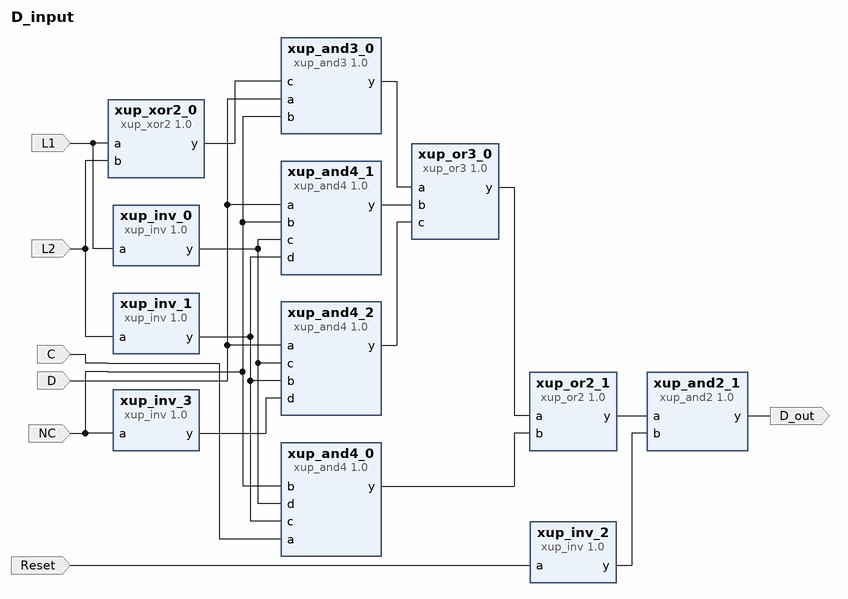
[diagram p0: block diagram of the top level]
# Vivado block design D_input, xc7a35tcpg236-1, Vivado 2017.4
create_bd_design D_input

create_bd_port -dir I L1
create_bd_port -dir I L2
create_bd_port -dir I C
create_bd_port -dir I NC
create_bd_port -dir O D_out
create_bd_port -dir I Reset
create_bd_port -dir I D

create_bd_cell -type ip -vlnv xilinx.com:XUP:xup_and4:1.0 xup_and4_0
create_bd_cell -type ip -vlnv xilinx.com:XUP:xup_xor2:1.0 xup_xor2_0
create_bd_cell -type ip -vlnv xilinx.com:XUP:xup_inv:1.0 xup_inv_0
create_bd_cell -type ip -vlnv xilinx.com:XUP:xup_inv:1.0 xup_inv_1
create_bd_cell -type ip -vlnv xilinx.com:XUP:xup_or2:1.0 xup_or2_1
create_bd_cell -type ip -vlnv xilinx.com:XUP:xup_and2:1.0 xup_and2_1
create_bd_cell -type ip -vlnv xilinx.com:XUP:xup_inv:1.0 xup_inv_2
create_bd_cell -type ip -vlnv xilinx.com:XUP:xup_and4:1.0 xup_and4_1
create_bd_cell -type ip -vlnv xilinx.com:XUP:xup_and3:1.0 xup_and3_0
create_bd_cell -type ip -vlnv xilinx.com:XUP:xup_and4:1.0 xup_and4_2
create_bd_cell -type ip -vlnv xilinx.com:XUP:xup_inv:1.0 xup_inv_3
create_bd_cell -type ip -vlnv xilinx.com:XUP:xup_or3:1.0 xup_or3_0

# ---- connections ----

connect_bd_net -net L1_1 [get_bd_ports L1] [get_bd_pins xup_inv_0/a] [get_bd_pins xup_xor2_0/a]
connect_bd_net -net L2_1 [get_bd_ports L2] [get_bd_pins xup_inv_1/a] [get_bd_pins xup_xor2_0/b]
connect_bd_net [get_bd_ports C] [get_bd_pins xup_and4_0/a]
connect_bd_net [get_bd_ports NC] [get_bd_pins xup_and4_0/b] [get_bd_pins xup_and4_1/b] [get_bd_pins xup_and3_0/b] [get_bd_pins xup_inv_3/a]
connect_bd_net [get_bd_pins xup_inv_1/y] [get_bd_pins xup_and4_0/c] [get_bd_pins xup_and4_1/d] [get_bd_pins xup_and4_2/b]
connect_bd_net [get_bd_pins xup_inv_0/y] [get_bd_pins xup_and4_0/d] [get_bd_pins xup_and4_1/c] [get_bd_pins xup_and4_2/c]
connect_bd_net [get_bd_pins xup_and4_0/y] [get_bd_pins xup_or2_1/b]
connect_bd_net [get_bd_pins xup_or2_1/y] [get_bd_pins xup_and2_1/a]
connect_bd_net [get_bd_pins xup_and2_1/y] [get_bd_ports D_out]
connect_bd_net [get_bd_pins xup_inv_2/y] [get_bd_pins xup_and2_1/b]
connect_bd_net [get_bd_ports Reset] [get_bd_pins xup_inv_2/a]
connect_bd_net [get_bd_ports D] [get_bd_pins xup_and4_1/a] [get_bd_pins xup_and3_0/a] [get_bd_pins xup_and4_2/a]
connect_bd_net [get_bd_pins xup_and4_1/y] [get_bd_pins xup_or3_0/b]
connect_bd_net [get_bd_pins xup_xor2_0/y] [get_bd_pins xup_and3_0/c]
connect_bd_net [get_bd_pins xup_and3_0/y] [get_bd_pins xup_or3_0/a]
connect_bd_net [get_bd_pins xup_inv_3/y] [get_bd_pins xup_and4_2/d]
connect_bd_net [get_bd_pins xup_and4_2/y] [get_bd_pins xup_or3_0/c]
connect_bd_net [get_bd_pins xup_or3_0/y] [get_bd_pins xup_or2_1/a]

validate_bd_design
save_bd_design
